# Altium schematic sheet PF4_DSPBypass.SchDoc
size 203 x 127 mm
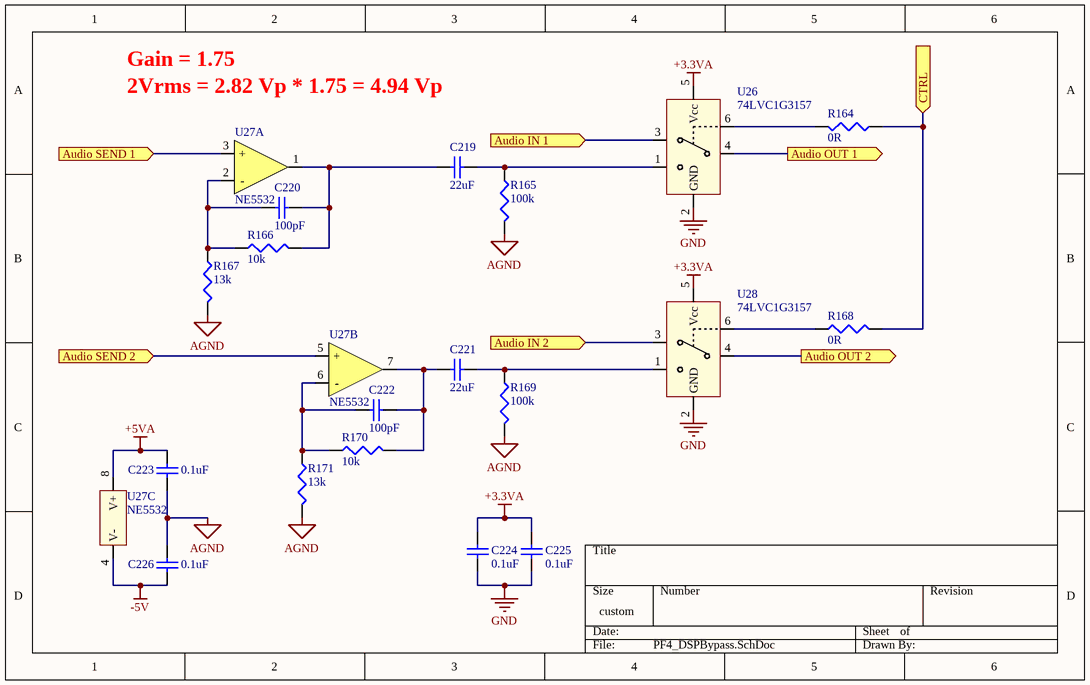
[diagram p0: PF4_DSPBypass.SchDoc]

## Parts
C219  22uF  [CAPC1608X08]
C220  100pF  [CAPC1608X08]
C221  22uF  [CAPC1608X08]
C222  100pF  [CAPC1608X08]
C223  0.1uF  [CAPC1608X08]
C224  0.1uF  [CAPC1608X08]
C225  0.1uF  [CAPC1608X08]
C226  0.1uF  [CAPC1608X08]
R164  0R  [RESC1608X05]
R165  100k  [RESC1608X05]
R166  10k  [RESC1608X05]
R167  13k  [RESC1608X05]
R168  0R  [RESC1608X05]
R169  100k  [RESC1608X05]
R170  10k  [RESC1608X05]
R171  13k  [RESC1608X05]
U26  74LVC1G3157  [DBV6-M]
U27  NE5532  [D8-M]  (parts A,B,C of 3)
U28  74LVC1G3157  [DBV6-M]

## Ports
Audio IN 1 (in), Audio IN 2 (in), Audio OUT 1 (out), Audio OUT 2 (out), Audio SEND 1 (in), Audio SEND 2 (in), CTRL (in)

## Nets
+3.3VA: C224.1 C225.1 U26.5(Vcc) U28.5(Vcc)
+5VA: C223.1 U27.8(V+)
-5V: C226.2 U27.4(V-)
AGND: C223.2 C226.1 R165.2 R167.2 R169.2 R171.2
GND: C224.2 C225.2 U26.2(GND) U28.2(GND)
Audio IN 1: U26.3(B1) ; port Audio IN 1
Audio IN 2: U28.3(B1) ; port Audio IN 2
Audio OUT 1: U26.4(A) ; port Audio OUT 1
Audio OUT 2: U28.4(A) ; port Audio OUT 2
Audio SEND 1: U27.3(+) ; port Audio SEND 1
Audio SEND 2: U27.5(+) ; port Audio SEND 2
CTRL: R164.1 R168.2 ; port CTRL
NetC219_1: C219.1 R165.1 U26.1(B2)
NetC219_2: C219.2 C220.2 R166.2 U27.1(OUT)
NetC220_1: C220.1 R166.1 R167.1 U27.2(-)
NetC221_1: C221.1 R169.1 U28.1(B2)
NetC221_2: C221.2 C222.2 R170.2 U27.7(OUT)
NetC222_1: C222.1 R170.1 R171.1 U27.6(-)
NetR164_2: R164.2 U26.6(S)
NetR168_1: R168.1 U28.6(S)

## Notes on the sheet
- Gain = 1.75
- 2Vrms = 2.82 Vp * 1.75 = 4.94 Vp

## Library data of the parts
C219 C221 = Cap Semi: Capacitor (Semiconductor SIM Model); Fabricant: MURATA; Fournisseur: Farnell; RefFabricant: GRM188R60J226MEA0D; RefFournisseur: 2666490; Value: 22uF; Case: 0603 [1608 Metric]; DataSheet: http://www.farnell.com/datasheets/1955681.pdf
C220 C222 = Cap Semi: Capacitor (Semiconductor SIM Model); Fabricant: MURATA; Fournisseur: Farnell; RefFabricant: GRT1885C1H101JA02D; RefFournisseur: 2672133; Value: 100pF; Case: 0603 [1608 Metric]; DataSheet: http://www.farnell.com/datasheets/2165936.pdf
C223-C226 = Cap Semi: Capacitor (Semiconductor SIM Model); Fabricant: MURATA; Fournisseur: Farnell; RefFabricant: GRM188F51E104ZA01D; RefFournisseur: 2821272; Value: 0.1uF; Case: 0603 [1608 Metric]; DataSheet: http://www.farnell.com/datasheets/2048672.pdf
R164 R168 = Res3: Resistor; Value: 0; Case: 0603 [1608 Metric]
R165 R169 = Res3: Resistor; Fabricant: TE CONNECTIVITY; Fournisseur: Farnell; RefFabricant: RN73C1J100KBTDF; RefFournisseur: 2687850; Value: 100k; Case: 0603 [1608 Metric]; DataSheet: http://www.farnell.com/datasheets/2189072.pdf
R166 R170 = Res3: Resistor; Fabricant: TE CONNECTIVITY; Fournisseur: Farnell; RefFabricant: CPF-A-0603B4K7E1; RefFournisseur: 2483933; Value: 10k; Case: 0603 [1608 Metric]; DataSheet: http://www.farnell.com/datasheets/1935020.pdf
R167 R171 = Res3: Resistor; Fabricant: TE CONNECTIVITY; Fournisseur: Farnell; RefFabricant: CPF0603B13KE1; RefFournisseur: 2330920; Value: 13k; Case: 0603 [1608 Metric]; DataSheet: http://www.farnell.com/datasheets/2104089.pdf
U26 U28 = 74LVC1G3157: Single 2:1 Multiplexer; Fabricant: NEXPERIA; Fournisseur: Farnell; RefFabricant: 74LVC1G3157GV,125; RefFournisseur: 2463921; DataSheet: http://www.farnell.com/datasheets/2053574.pdf
U27 = NE5532: Dual Audio OpAmp; Fournisseur: Farnell; RefFournisseur: 1103060; Fabricant: TEXAS INSTRUMENTS; RefFabricant: NE5532; DataSheet: http://www.ti.com/lit/ds/symlink/ne5532a.pdf